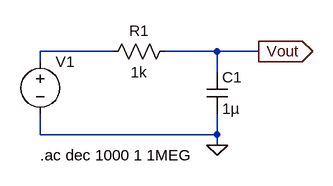
[diagram p0: schematic RC_low_pass.asc]
RC_low_pass.asc, the LTspice schematic file:
Version 4
SHEET 1 880 680
WIRE 144 112 32 112
WIRE 304 112 224 112
WIRE 368 112 304 112
WIRE 32 128 32 112
WIRE 304 144 304 112
WIRE 32 240 32 208
WIRE 304 240 304 208
WIRE 304 240 32 240
WIRE 304 256 304 240
FLAG 304 256 0
FLAG 368 112 Vout
IOPIN 368 112 Out
SYMBOL cap 288 144 R0
SYMATTR InstName C1
SYMATTR Value 1µ
SYMBOL res 240 96 R90
WINDOW 0 0 56 VBottom 2
WINDOW 3 32 56 VTop 2
SYMATTR InstName R1
SYMATTR Value 1k
SYMBOL voltage 32 112 R0
WINDOW 39 0 0 Left 0
SYMATTR InstName V1
SYMATTR Value ""
SYMATTR Value2 AC 1
TEXT 32 272 Left 2 !.ac dec 1000 1 1MEG

The netlist it stands for:
* RC_low_pass.asc
C1 Vout 0 1µ
R1 Vout N001 1k
V1 N001 0 AC 1
.ac dec 1000 1 1MEG
.backanno
.end